# EAGLE design pulsegen (EAGLE 6.5.0)
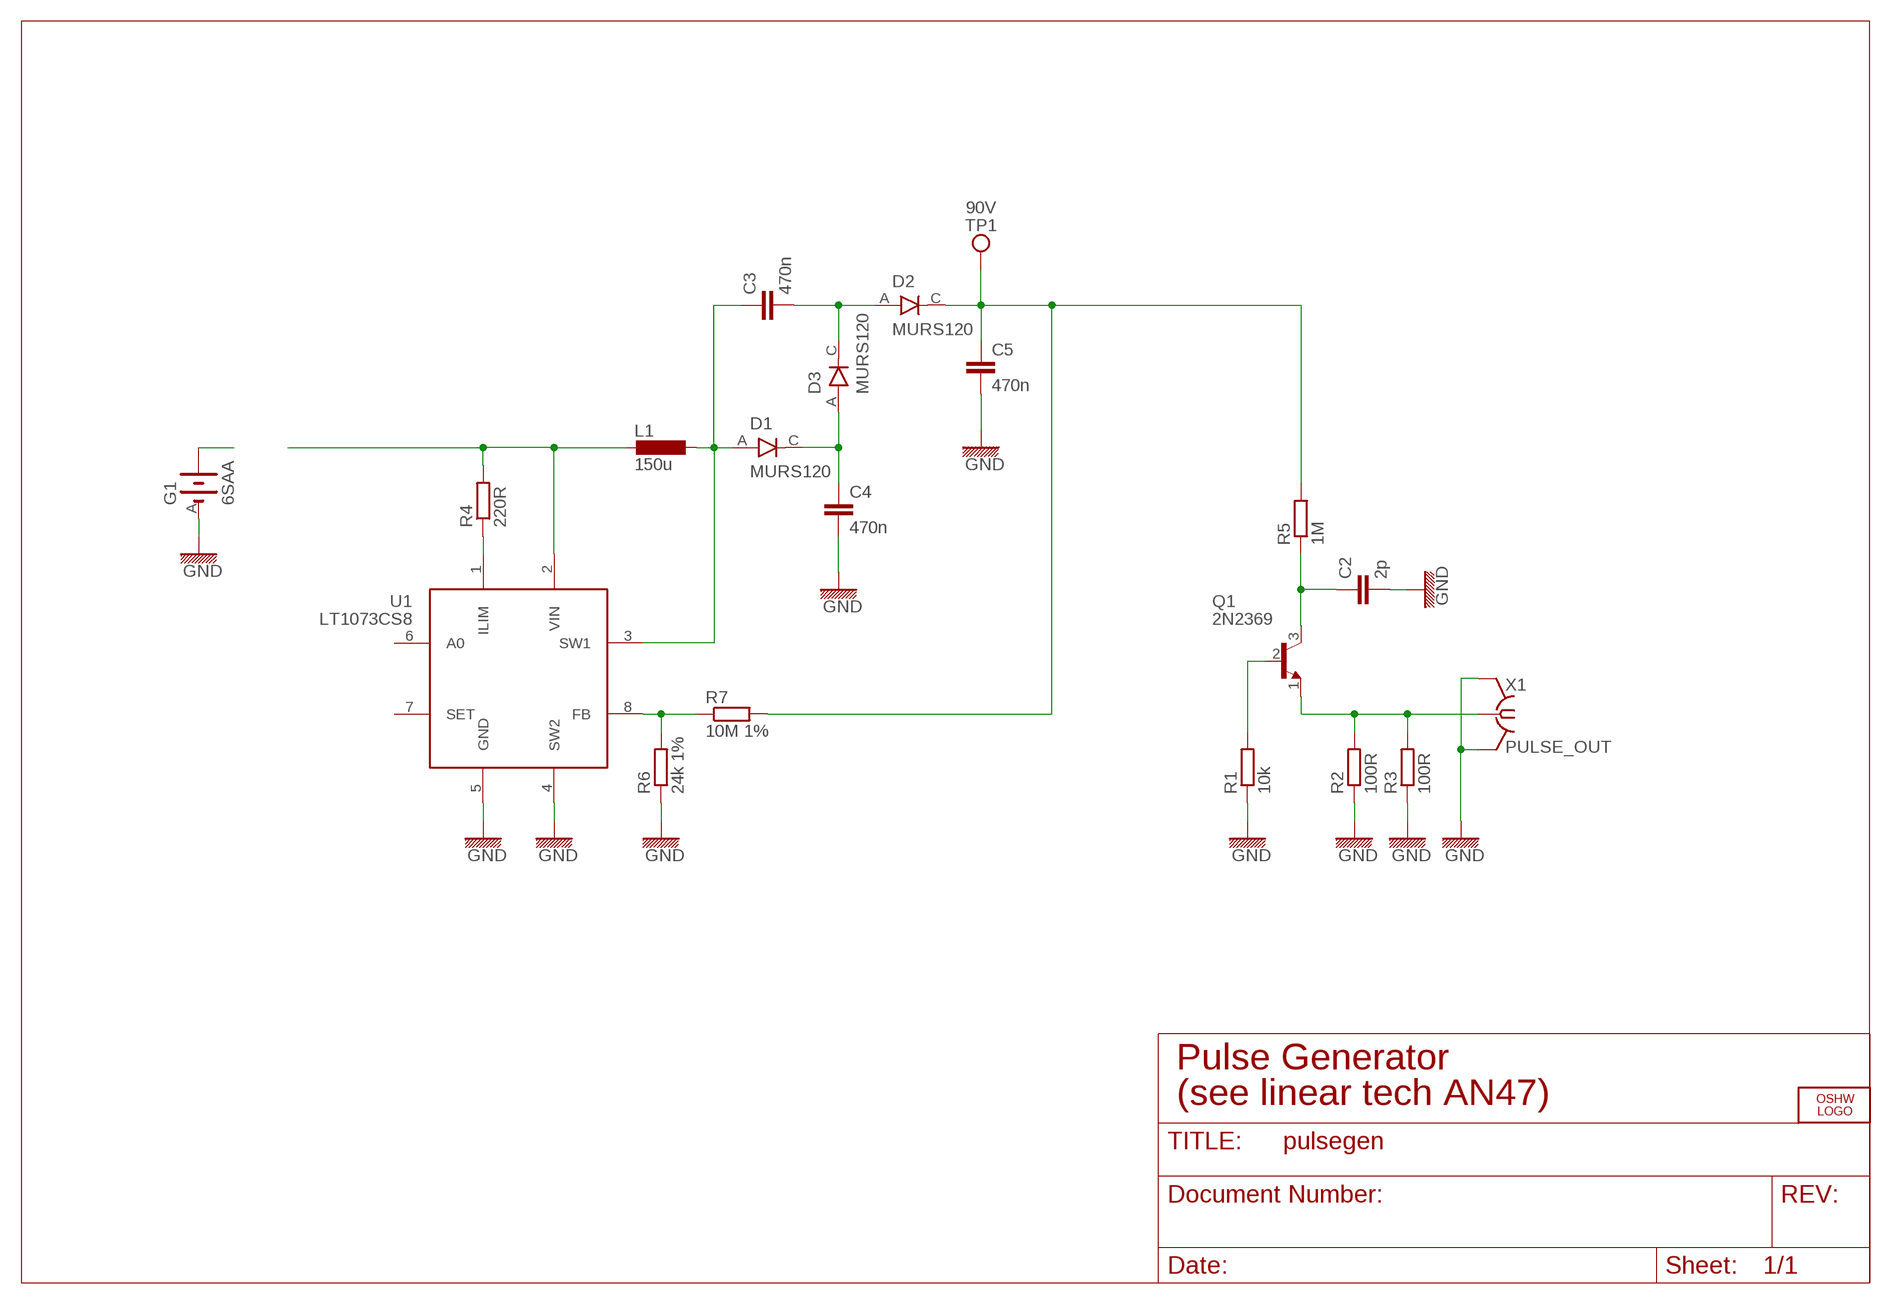
[diagram p0: schematic, sheet 1]

## Parts
C2  2p  C-EU_0805  [0805]
C3  470n  C-EU_1210  [1210]
C4  470n  C-EU_1210  [1210]
C5  470n  C-EU_1210  [1210]
D1  MURS120  D-EU  [SMB_DIODE]
D2  MURS120  D-EU  [SMB_DIODE]
D3  MURS120  D-EU  [SMB_DIODE]
G1  6SAA  BATTERY_6SAA  [6SAA]
L1  150u  L-EU_WE_PD_M  [L_WE_PD_M]
LOGO1  OSHW_LOGO_FILLX0100-NT  [OSHW_FILLX100_NOTEXT]
Q1  2N2369  TRANS_NPN_TO18_EBC  [TO18]
R1  10k  R-EU_0805  [0805]
R2  100R  R-EU_0805  [0805]
R3  100R  R-EU_0805  [0805]
R4  220R  R-EU_0805  [0805]
R5  1M  R-EU_0805  [0805]
R6  24k 1%  R-EU_0805  [0805]
R7  10M 1%  R-EU_0805  [0805]
TP1  90V  TESTPAD  [TP_1X1]
U1  LT1073CS8  [SO8]
X1  PULSE_OUT  BNC-F  [BNC-EDGE-BIVB]

## Nets
90V: C5.1 D2.C R5.2 R7.2 TP1.TP
BASE: Q1.2(B) R1.2
CHARGE: C2.1 Q1.3(C) R5.1
FB: R6.2 R7.1 U1.8(FB)
GND: C2.2 C4.2 C5.2 G1.A R1.1 R2.1 R3.1 R6.1 U1.4(SW2) U1.5(GND) X1.GND@1(GND) X1.GND@2(GND)
N1: C4.1 D1.C D3.A
N2: C3.2 D2.A D3.C
N$1: G1.C
N$2: R4.1 U1.1(ILIM)
PULSE: Q1.1(E) R2.2 R3.2 X1.C
SW1: C3.1 D1.A L1.1 U1.3(SW1)
VIN: L1.2 R4.2 U1.2(VIN)
Unconnected: U1.6(A0) U1.7(SET)

## Notes on the sheet
- Pulse Generator
- (see linear tech AN47)

## Library data of the parts
C2-C5 = we_passive:C-EU: Capacitor
D1-D3 = we_passive:D-EU: Diode
G1 = pulsegen-pcb:BATTERY: NC ACCU Varta
L1 = we_passive:L-EU: Inductor
LOGO1 = ohw-logo:OSHW_LOGO_FILL
Q1 = we_passive:TRANS_NPN
R1-R7 = we_passive:R-EU: Resistor
TP1 = we_conn:TESTPAD: Test Pad
U1 = we_chips:LT1073: LT1073 Linear Technology Micropower DC/DC converter (Adjustable & Fixed 5V/12V)
X1 = we_conn:BNC-F

## Board
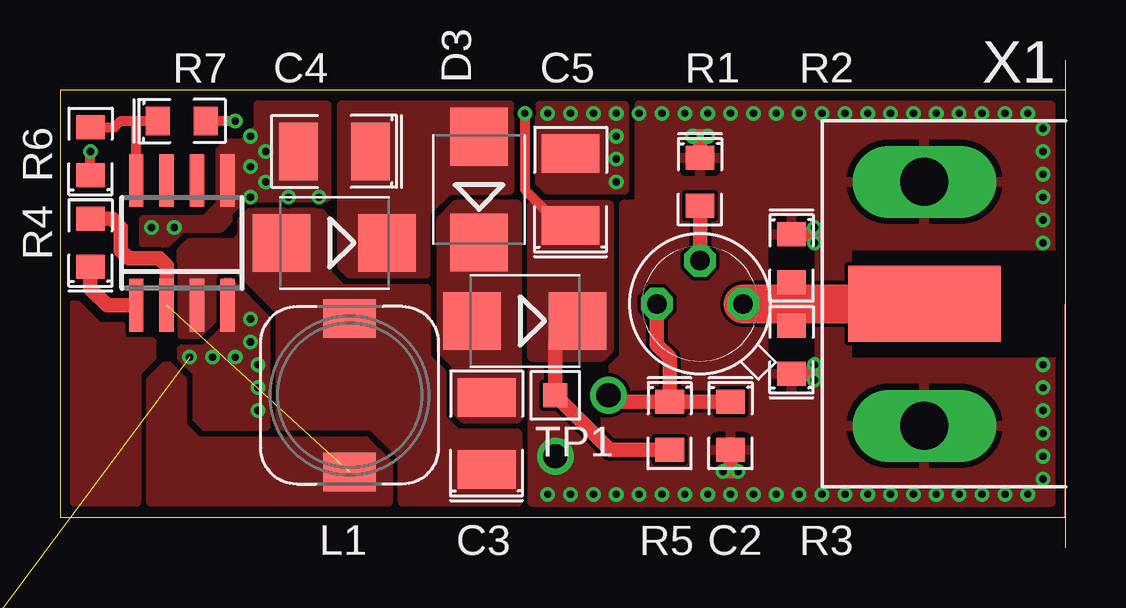
[diagram p1: board, top side]
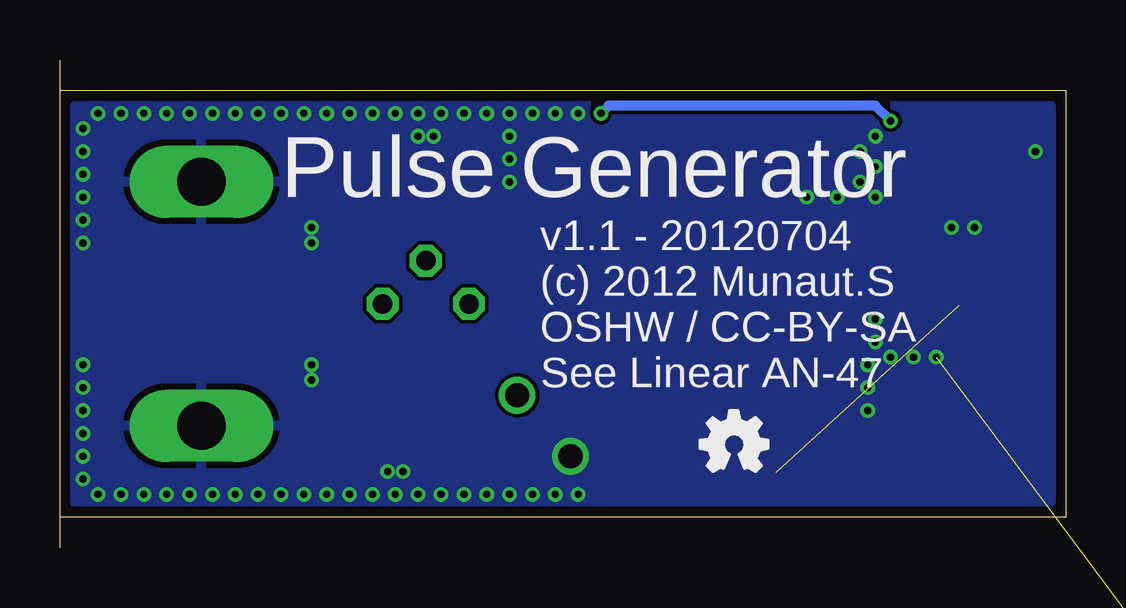
[diagram p2: board, bottom side, seen from below]

Size 41.91 x 17.78 mm. Coordinates in mm from the lower left corner, seen from the top.
Outline: 0,0 41.89,0 41.91,17.78 0,17.78 0,0
Copper layers (1*16): Top 0.035mm / dielectric 1.5mm / Bottom 0.035mm
Design rules "default": minimum track width 6mil, minimum drill 12mil, track to track 6mil, track to pad 6mil, pad to pad 6mil, via to via 6mil, smd to smd 0mil, copper to edge 10mil, drill to drill 10mil, minimum pad ring 10mil, minimum via ring 6mil, stop-mask expansion 2mil, vias tented up to drill 100mil, thermal gap 10mil
tRestrict: area 33,6.7 to 41.6,11.1; area 29.5,10.2 to 31.4,11.4; area 29.5,6.3 to 31.4,7.6

### Footprints (pad centres in the part's own frame; a part is rotated, then mirrored left to right if it is on the bottom)
0805 = smd 1 x 1.2: 1 -1,0; 2 1,0
1210 = smd 1.6 x 2.4: 1 -1.5,0; 2 1.5,0
SMB_DIODE = smd 2.4 x 2.4: A 2.2,0; C -2.2,0
6SAA = drill 1.27 octagon: A -27.178,0; C 27.178,0 | hole 2.032: 27.178,-7.112 | hole 3.302: -20.447,0; 20.447,0
L_WE_PD_M = smd 2.2 x 1.6: 1 0,3.2; 2 0,-3.2
TO18 = drill 0.813 octagon: 1 -1.27,-1.27; 2 1.27,-1.27; 3 1.27,1.27
TP_1X1 = smd 1 x 1: TP 0,0
SO8 = smd 0.6 x 2.2: 1 -1.905,-2.6; 2 -0.635,-2.6; 3 0.635,-2.6; 4 1.905,-2.6; 5 1.905,2.6; 6 0.635,2.6; 7 -0.635,2.6; 8 -1.905,2.6
BNC-EDGE-BIVB = smd 6.35 x 3.175: C 5.893,0 | drill 2.007 long: GND@1 5.893,5.08; GND@2 5.893,-5.08

### Placement (x,y rotation side)
C2  27.94,3.81 270 top
C3  17.78,3.49 90 top
C4  11.43,15.24 180 top
C5  21.27,13.65 90 top
D1  11.43,11.43 180 top
D2  19.37,8.18 180 top
D3  17.46,13.65 90 top
G1  14.61,-17.46 0 top  (outside the outline)
L1  12.06,5.08 0 top
LOGO1  15.24,1.91 0 bottom
Q1  26.67,8.89 135 top
R1  26.67,13.97 270 top
R2  30.48,10.79 270 top
R3  30.48,6.99 90 top
R4  1.27,11.43 90 top
R5  25.4,3.81 270 top
R6  1.27,15.24 90 top
R7  5.08,16.51 0 top
TP1  20.64,5.08 0 top
U1  5.08,11.43 0 top
X1  41.91,8.89 180 top

### Tracks (layer width: path | path; a pad name or v marks a point on that pad's centre or on a via)
90V  (via drill 0.3)
  Top 0.406: R7.2 v7.3,16.51 | v19.37,16.83 19.37,13.65 20.95,12.06 21.27,12.06 C5.1
  Top 0.61: D2.C 20.64,7.33 TP1.TP 22.91,2.81 R5.2
  Bottom 0.406: v7.3,16.51 7.94,17.14 19.05,17.14 v19.37,16.83
  pour Top (no thermals): 19.68,13.02 22.86,13.02 22.86,6.99 22.54,6.67 19.68,6.67
BASE
  Top 0.61: R1.2 Q1.2
CHARGE  (via drill 1.02)
  Top 0.61: Q1.3 24.87,7.19 25.4,6.67 R5.1 | C2.1 R5.1 | R5.1 23.13,4.81 v22.86,5.08
FB
  Top 0.406: R6.2 2.27,16.24 2.54,16.51 3.17,16.51 | 3.17,16.51 R7.1 4.13,16.51 | U1.8 3.17,16.51
GND  (via drill 0.3, 1.02)  (1 unrouted)
  Top 0.406: R6.1 v1.27,15.24
  Top 0.61: v26.99,15.88 v26.35,15.88 26.67,15.88 R1.1 | v31.43,12.06 v31.43,11.43 arc90 31.07,11.79 R2.1 | v31.43,5.71 v31.43,6.35 arc-90 31.07,5.99 R3.1 | v28.26,1.91 v27.62,1.91 arc90 27.94,2.22 C2.2
  other vias: 20.64,2.54 7.94,8.26 7.94,7.3 7.3,6.67 6.35,6.67 5.4,6.67 8.26,4.45 8.26,5.4 8.26,6.35 3.81,12.06 4.76,12.06 7.94,13.34 7.94,14.61 7.94,15.88 8.57,15.24 8.57,13.97 9.53,13.34 10.79,13.34 20.32,16.83 21.27,16.83 22.23,16.83 23.18,16.83 23.18,15.88 23.18,14.92 23.18,13.97 24.13,16.83 25.08,16.83 26.04,16.83 26.99,16.83 27.94,16.83 28.89,16.83 29.84,16.83 30.8,16.83 31.75,16.83 32.7,16.83 33.66,16.83 34.61,16.83 35.56,16.83 36.51,16.83 37.47,16.83 38.42,16.83 39.37,16.83 40.32,16.83 23.18,0.95 22.23,0.95 21.27,0.95 20.32,0.95 24.13,0.95 25.08,0.95 26.04,0.95 26.99,0.95 27.94,0.95 28.89,0.95 29.84,0.95 30.8,0.95 31.75,0.95 32.7,0.95 33.66,0.95 34.61,0.95 35.56,0.95 36.51,0.95 37.47,0.95 38.42,0.95 39.37,0.95 40.32,0.95 40.96,1.59 40.96,2.54 40.96,3.49 40.96,4.45 40.96,5.4 40.96,6.35 40.96,16.19 40.96,15.24 40.96,14.29 40.96,13.34 40.96,12.38 40.96,11.43
  pour Bottom: 0.64,0.64 41.27,0.64 41.27,17.14 0.64,17.14
  pour Top (no thermals): 5.08,6.99 5.08,6.67 5.71,6.03 5.71,4.13 6.03,3.81 8.57,3.81 8.57,8.26 6.99,9.84 6.99,7.94 6.03,6.99
  pour Top (no thermals): 11.11,17.14 8.26,17.14 8.26,16.19 7.62,15.56 6.99,15.56 6.67,15.24 6.67,13.02 6.03,12.38 3.49,12.38 3.49,11.43 4.45,11.43 5.08,12.06 6.67,12.06 6.99,12.38 6.99,12.7 7.62,13.34 11.11,13.34
  pour Top (no thermals): 20.32,13.65 20,13.97 20,17.14 23.5,17.14 23.5,13.65 20.64,13.65
  pour Top: 0.64,8.89 1.59,7.94 2.54,7.94 2.54,7.3 3.81,7.3 3.81,6.67 3.17,6.03 3.17,0.64 0.64,0.64
  pour Top: 24.13,17.14 24.13,13.02 23.5,13.02 23.5,6.67 22.86,6.03 19.68,6.03 19.68,0.64 41.27,0.64 41.27,17.14
N1
  pour Top (no thermals): 11.75,10.48 12.06,10.16 15.24,10.16 15.24,12.7 16.19,13.65 18.73,13.65 18.73,17.14 11.75,17.14
N2
  pour Top (no thermals): 16.51,13.02 15.88,12.38 15.88,6.99 16.51,6.35 16.51,4.45 16.83,4.13 19.05,4.13 19.05,13.02
N$2
  Top 0.61: R4.1 1.27,9.53 1.97,8.83 U1.1
PULSE
  Top 0.61: R2.2 30.48,9.21 30.16,8.89 30.48,8.57 R3.2
  Top 1.626: Q1.1 30.16,8.89 35.56,8.89 | 35.56,8.89 | 35.56,8.89 X1.C
SW1
  pour Top (no thermals): 16.51,3.49 19.05,3.49 19.05,0.64 14.29,0.64 14.29,2.54 13.02,3.81 9.21,3.81 9.21,8.57 7.3,10.48 6.35,10.48 6.35,8.26 5.71,7.62 5.08,7.62 5.08,11.11 5.4,11.43 7.3,11.43 7.62,11.75 7.62,12.38 7.94,12.7 10.79,12.7 11.11,12.38 11.11,10.16 11.75,9.53 15.24,9.53 15.24,6.67 15.88,6.03 15.88,4.13
VIN  (1 unrouted)
  Top 0.61: U1.2 4.45,10.48 4.13,10.79 2.86,10.79 2.54,11.11 2.54,12.06 2.17,12.43 R4.2
  pour Top (no thermals): 3.81,5.71 4.45,6.35 5.08,5.71 5.08,3.81 5.71,3.17 12.7,3.17 13.65,2.22 13.65,0.64 3.81,0.64

### Text on the board
bPlace: Pulse Generator | v1.1 - 20120704 | (c) 2012 Munaut.S | OSHW / CC-BY-SA | See Linear AN-47